# EAGLE design blink1_v1a (EAGLE 6.3)
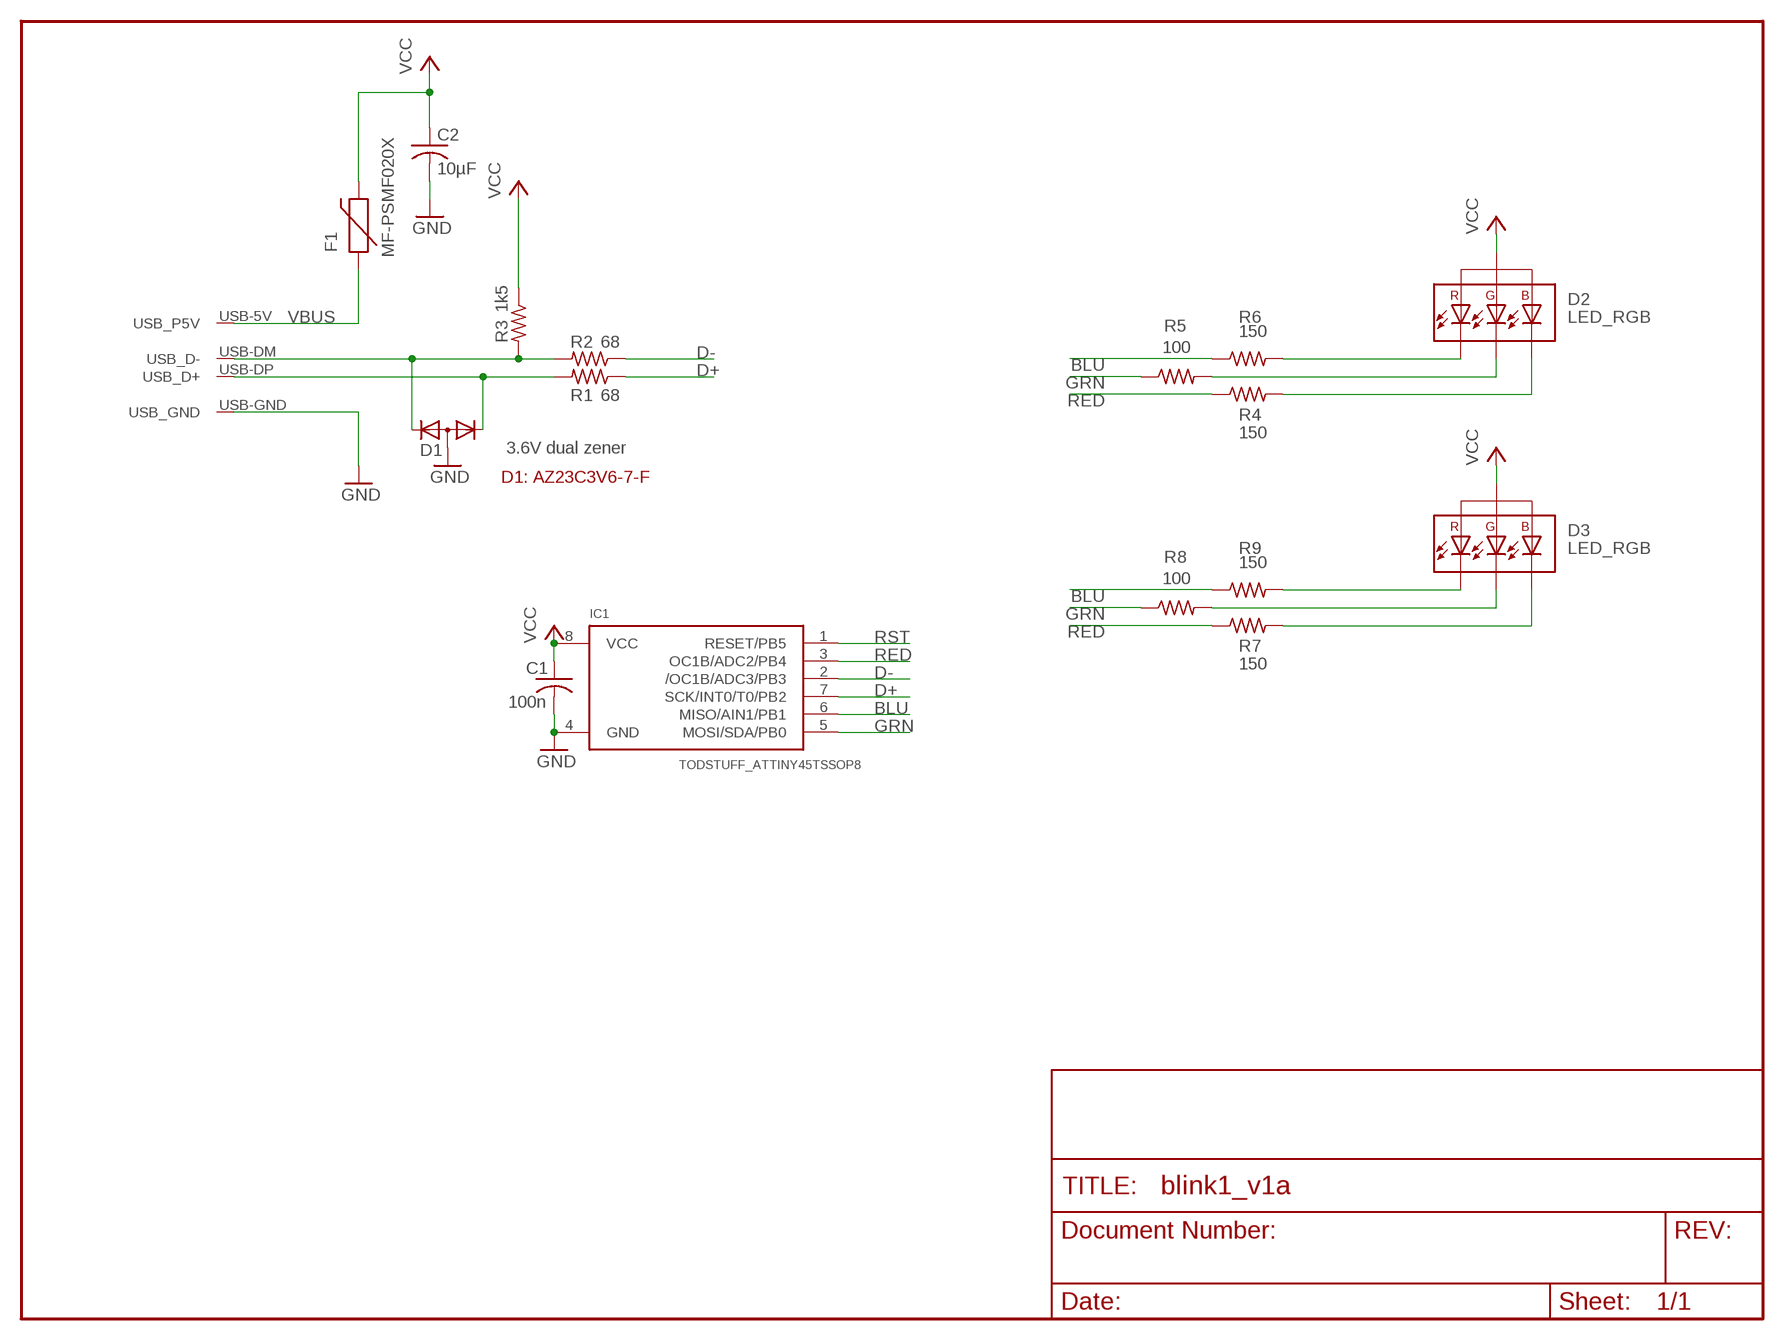
[diagram p0: schematic, sheet 1]

## Parts
C1  100n  C-USC0402  [C0402]
C2  10µF  C-USC0603  [C0603]
D1  3.6V dual zener  DIODE-2CA|ACSOT23  [SOT23]
D2  LED_RGB  [LED_1010]
D3  LED_RGB  [LED_1010]
F1  MF-PSMF020X  PTC0805  [0805]
IC1  TODSTUFF_ATTINY45TSSOP8  [TSSOP8]
R1  68  R-US_R0402  [R0402]
R2  68  R-US_R0402  [R0402]
R3  1k5  R-US_R0402  [R0402]
R4  150  R-US_R0402  [R0402]
R5  100  R-US_R0402  [R0402]
R6  150  R-US_R0402  [R0402]
R7  150  R-US_R0402  [R0402]
R8  100  R-US_R0402  [R0402]
R9  150  R-US_R0402  [R0402]
U$1  PCB-USB-DEV  [PCB-USB-PAC]

## Nets
BLU: IC1.6(MISO/AIN1/PB1) R6.1 R9.1
D+: IC1.7(SCK/INT0/T0/PB2) R1.1
D-: IC1.2(/OC1B/ADC3/PB3) R2.1
GND: C1.2 C2.2 D1.3(A) IC1.4(GND) U$1.USB-GND(USB_GND)
GRN: IC1.5(MOSI/SDA/PB0) R5.1 R8.1
N$4: D1.1(K1) R1.2 U$1.USB-DP(USB_D+)
N$5: D1.2(K2) R2.2 R3.2 U$1.USB-DM(USB_D-)
RBLU: D2.2(C_R) R6.2
RBLU1: D3.2(C_R) R9.2
RED: IC1.3(OC1B/ADC2/PB4) R4.1 R7.1
RGRN: D2.4(C_G) R5.2
RGRN1: D3.4(C_G) R8.2
RRED: D2.3(C_B) R4.2
RRED1: D3.3(C_B) R7.2
RST: IC1.1(RESET/PB5)
VBUS: F1.1 U$1.USB-5V(USB_P5V)
VCC: C1.1 C2.1 D2.1(A) D3.1(A) F1.2 IC1.8(VCC) R3.1

## Notes on the sheet
- D1: AZ23C3V6-7-F

## Library data of the parts
C1 C2 = rcl:C-US: CAPACITOR, American symbol
D1 = diode:DIODE-2CA|AC: Dual DIODE Cathode-Anode|Anode-Cathode
D2 D3 = blink1_v1a:LED_RGB
F1 = todstuff:PTC
IC1 = blink1_v1a:TODSTUFF_ATTINY45
R1-R9 = rcl:R-US_: RESISTOR, American symbol
U$1 = PCB-USB:PCB-USB-DEV

## Board
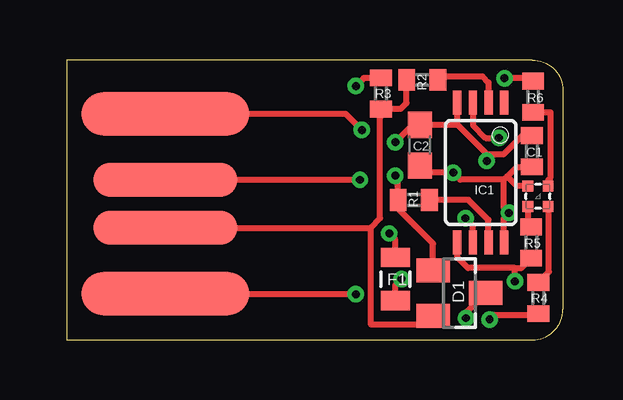
[diagram p1: board, top side]
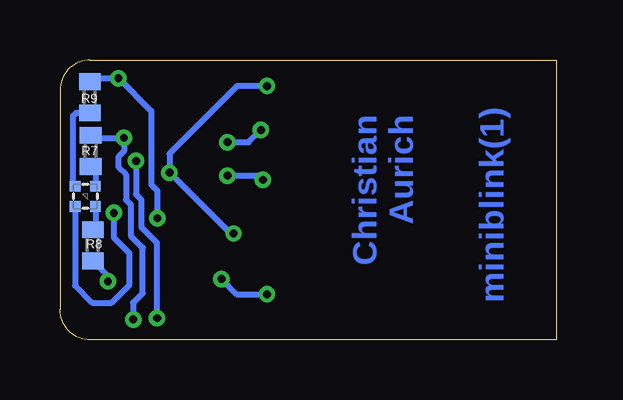
[diagram p2: board, bottom side, seen from below]

Size 20.7 x 11.68 mm. Coordinates in mm from the lower left corner, seen from the top.
Outline: 0,0 19.43,0 arc90 20.7,1.27 20.7,10.41 arc90 19.43,11.68 0,11.68 0,0
Copper layers (1*16): Top 0.0356mm / dielectric 1.5011mm / Bottom 0.0356mm
Design rules "default *": minimum track width 6mil, minimum drill 0.3mm, track to track 6mil, track to pad 6mil, pad to pad 6mil, via to via 6mil, smd to smd 6mil, copper to edge 15mil, drill to drill 8mil, minimum pad ring 7mil, minimum via ring 7mil, stop-mask expansion 0.04mm, vias tented up to drill 25mil, thermal gap 10mil

### Footprints (pad centres in the part's own frame; a part is rotated, then mirrored left to right if it is on the bottom)
C0402 = smd 0.7 x 0.9: 1 -0.65,0; 2 0.65,0
C0603 = smd 1.1 x 1: 1 -0.85,0; 2 0.85,0
SOT23 = smd 1 x 1.4: 1 -0.95,-1.1; 2 0.95,-1.1; 3 0,1.1
LED_1010 = smd 0.45 x 0.45: 1 -0.425,0.425; 2 0.425,0.425; 3 0.425,-0.425; 4 -0.425,-0.425
0805 = smd 0.8 x 1.2: 1 -0.9,0; 2 0.9,0
TSSOP8 = smd 0.35 x 1: 1 -0.975,-2.925; 2 -0.325,-2.925; 3 0.325,-2.925; 4 0.975,-2.925; 5 0.975,2.925; 6 0.325,2.925; 7 -0.325,2.925; 8 -0.975,2.925
R0402 = smd 0.7 x 0.9: 1 -0.65,0; 2 0.65,0
PCB-USB-PAC = smd 7 x 1.8: USB-5V -4,9.75; USB-GND -4,2.25 | smd 6 x 1.4: USB-DM -4,7; USB-DP -4,5

### Placement (x,y rotation side)
C1  19.41,7.87 90 top
C2  14.73,8.13 90 top
D1  16.38,1.96 270 top
D2  19.66,5.99 0 top
D3  19.64,5.99 90 bottom
F1  13.72,2.54 90 top
IC1  17.27,6.99 180 top
R1  14.48,5.84 180 top
R2  14.83,10.85 180 top
R3  13.11,10.28 270 top
R4  19.68,1.75 90 top
R5  19.38,4.07 90 top
R6  19.46,10.14 270 top
R7  19.42,7.89 270 bottom
R8  19.33,3.95 90 bottom
R9  19.46,10.12 270 bottom
U$1  0.13,11.68 180 top

### Tracks (layer width: path | path; a pad name or v marks a point on that pad's centre or on a via)
BLU  (via drill 0.33)
  Top 0.25: IC1.6 16.95,4.77 v16.64,5.08 | R6.1 19.33,10.92 v18.26,10.92
  Bottom 0.25: v16.64,5.08 16.64,6.22 16.89,6.48 16.89,9.55 v18.26,10.92 19.31,10.92 R9.1
D+
  Top 0.25: IC1.7 17.6,5.01 16.76,5.84 R1.1
D-
  Top 0.25: IC1.2 17.6,10.74 17.35,11 15.64,11 R2.1
GND  (via drill 0.33)
  Top 0.25: 16.3,8.98 IC1.4 | 16.3,8.98 17.53,7.75 | 16.3,8.98 C2.2 14.44,8.98 v13.72,8.26 | v17.53,7.47 17.53,7.75 | v12.32,8.76 11.65,9.43 U$1.USB-GND | 17.53,7.75 18.24,7.75 19.02,8.53 C1.2 | D1.3 16.66,1.13 v16.66,0.91
  Bottom 0.25: v13.72,8.26 12.83,8.26 v12.32,8.76 | v17.53,7.47 17.53,6.07 17.3,5.84 17.3,4.7 16.66,4.06 v16.66,0.91
GRN  (via drill 0.33)
  Top 0.25: 18.7,3 16.74,3 16.3,3.44 IC1.5 | v18.7,2.45 18.7,3 | 18.7,3 18.96,3 R5.1
  Bottom 0.25: v18.7,2.45 18.7,2.67 R8.1
N$4  (via drill 0.33)
  Top 0.25: v13.72,6.86 13.83,6.75 R1.2 13.83,5.48 15.28,4.02 D1.1 | U$1.USB-DP v12.24,6.68
  Bottom 0.25: v13.72,6.86 12.41,6.86 v12.24,6.68
N$5
  Top 0.16: 14.96,0.64 15.28,0.95 D1.2
  Top 0.25: U$1.USB-DM 12.69,4.68 12.7,4.7 | 14.96,0.64 12.7,0.64 12.7,4.7 | 12.7,4.7 13.08,5.08 13.08,9.27 13.11,9.3 R3.2 13.13,9.65 13.95,9.65 14.18,9.89 R2.2
RBLU
  Top 0.25: D2.2 20.09,6.67 20.19,6.78 20.19,9.49 R6.2
RBLU1
  Bottom 0.25: R9.2 20.02,9.47 20.15,9.35 20.15,6.5 D3.2
RED  (via drill 0.33)
  Top 0.25: IC1.3 16.95,8.96 17.48,8.43 v18.03,8.43 | R4.1 19.62,1.04 17.83,1.04 v17.64,0.85
  Bottom 0.25: v17.64,0.85 v17.65,0.86 17.65,1.55 17.25,1.95 17.25,3.85 17.75,4.35 17.75,5.65 17.95,5.85 17.95,6.9 18.25,7.2 18.25,7.66 18.03,7.87 v18.03,8.43 19.32,8.43 R7.1
RGRN
  Top 0.25: D2.4 19.23,4.81 19.29,4.81 R5.2
RGRN1
  Bottom 0.25: D3.4 19.22,4.82 arc90 R8.2
RRED
  Top 0.25: R4.2 20.12,2.84 20.12,5.54 D2.3
RRED1
  Bottom 0.25: R7.2 19.22,7.04 D3.3
VBUS  (via drill 0.33)
  Top 0.25: v12.06,1.91 4.16,1.91 U$1.USB-5V | F1.1 13.72,2.29 v13.97,2.54
  Bottom 0.25: v13.97,2.54 13.34,1.91 v12.06,1.91
VCC  (via drill 0.33)
  Top 0.25: 18.38,6.82 18.25,6.69 | 18.25,6.69 16.42,6.69 v16.13,6.99 15.03,6.99 C2.1 | R3.1 12.4,10.93 v12.06,10.59 | F1.2 13.72,4.19 v13.46,4.45 | D2.1 18.78,6.42 18.38,6.82 | IC1.8 18.25,5.1 v18.45,5.3 18.25,5.5 18.25,6.69 | 18.38,6.82 18.78,7.22 C1.1
  Bottom 0.25: v12.06,10.59 13.31,10.59 16.13,7.77 v16.13,6.99 13.59,4.45 v13.46,4.45 | D3.1 20.07,2.27 19.35,1.55 18.55,1.55 17.8,2.3 17.8,3.61 18.45,4.26 v18.45,5.3

### Text on the board
Bottom: Christian / Aurich | miniblink(1)